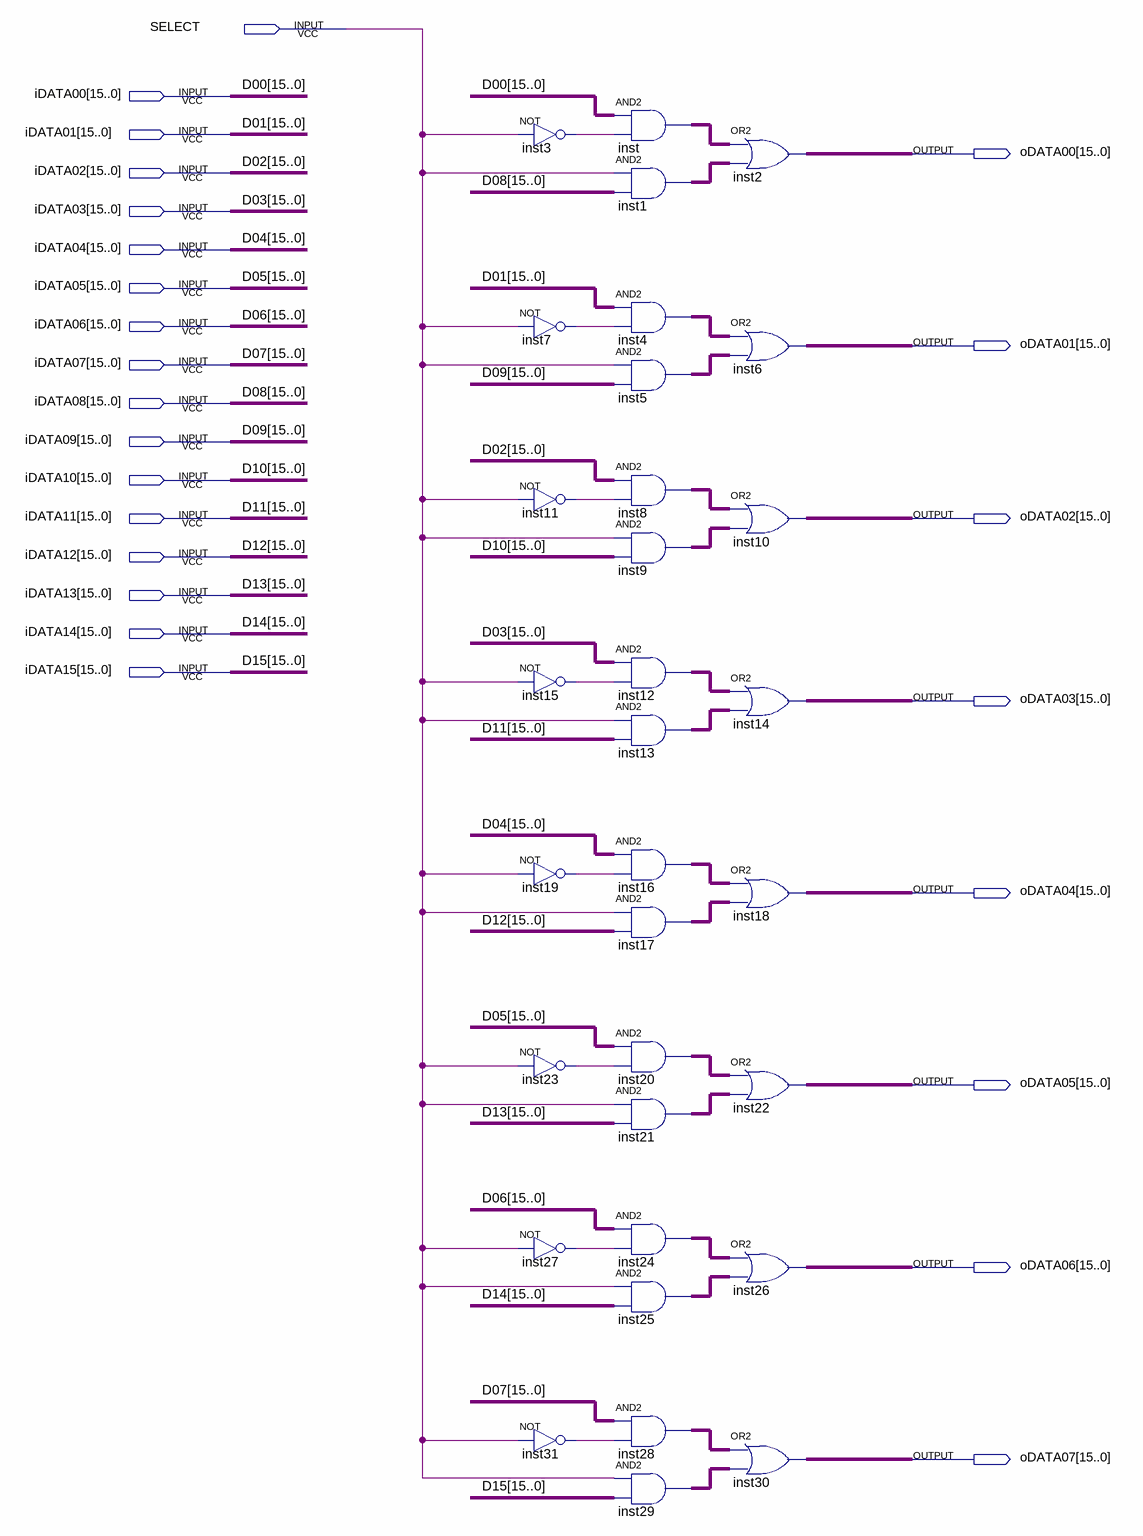
[diagram p0: schematic sheet]
// Quartus schematic disp_selecter.bdf as structural Verilog: 32 symbols, 25 pins
module disp_selecter (
  input  SELECT,
  input  [15:0] iDATA00,
  input  [15:0] iDATA01,
  input  [15:0] iDATA02,
  input  [15:0] iDATA03,
  input  [15:0] iDATA04,
  input  [15:0] iDATA05,
  input  [15:0] iDATA06,
  input  [15:0] iDATA07,
  input  [15:0] iDATA08,
  input  [15:0] iDATA09,
  input  [15:0] iDATA10,
  input  [15:0] iDATA11,
  input  [15:0] iDATA12,
  input  [15:0] iDATA13,
  input  [15:0] iDATA14,
  input  [15:0] iDATA15,
  output [15:0] oDATA00,
  output [15:0] oDATA01,
  output [15:0] oDATA02,
  output [15:0] oDATA03,
  output [15:0] oDATA04,
  output [15:0] oDATA05,
  output [15:0] oDATA06,
  output [15:0] oDATA07
);

  wire inst3_out, inst7_out, inst11_out, inst15_out, inst19_out, inst23_out, inst27_out, inst31_out;
  wire [15:0] inst1_out, inst4_out, inst5_out, inst8_out, inst9_out, inst12_out, inst13_out, inst16_out,
       inst17_out, inst20_out, inst21_out, inst24_out, inst25_out, inst28_out, inst29_out, inst_out;

  not inst3 (inst3_out, SELECT);
  not inst7 (inst7_out, SELECT);
  not inst11 (inst11_out, SELECT);
  not inst15 (inst15_out, SELECT);
  not inst19 (inst19_out, SELECT);
  not inst23 (inst23_out, SELECT);
  not inst27 (inst27_out, SELECT);
  not inst31 (inst31_out, SELECT);
  assign inst_out = iDATA00 & {16{inst3_out}};  // AND2 inst, 16 bits wide
  assign inst1_out = {16{SELECT}} & iDATA08;  // AND2 inst1, 16 bits wide
  assign inst4_out = iDATA01 & {16{inst7_out}};  // AND2 inst4, 16 bits wide
  assign inst5_out = {16{SELECT}} & iDATA09;  // AND2 inst5, 16 bits wide
  assign inst8_out = iDATA02 & {16{inst11_out}};  // AND2 inst8, 16 bits wide
  assign inst9_out = {16{SELECT}} & iDATA10;  // AND2 inst9, 16 bits wide
  assign inst12_out = iDATA03 & {16{inst15_out}};  // AND2 inst12, 16 bits wide
  assign inst13_out = {16{SELECT}} & iDATA11;  // AND2 inst13, 16 bits wide
  assign inst16_out = iDATA04 & {16{inst19_out}};  // AND2 inst16, 16 bits wide
  assign inst17_out = {16{SELECT}} & iDATA12;  // AND2 inst17, 16 bits wide
  assign inst20_out = iDATA05 & {16{inst23_out}};  // AND2 inst20, 16 bits wide
  assign inst21_out = {16{SELECT}} & iDATA13;  // AND2 inst21, 16 bits wide
  assign inst24_out = iDATA06 & {16{inst27_out}};  // AND2 inst24, 16 bits wide
  assign inst25_out = {16{SELECT}} & iDATA14;  // AND2 inst25, 16 bits wide
  assign inst28_out = iDATA07 & {16{inst31_out}};  // AND2 inst28, 16 bits wide
  assign inst29_out = {16{SELECT}} & iDATA15;  // AND2 inst29, 16 bits wide
  assign oDATA00 = inst_out | inst1_out;  // OR2 inst2, 16 bits wide
  assign oDATA01 = inst4_out | inst5_out;  // OR2 inst6, 16 bits wide
  assign oDATA02 = inst8_out | inst9_out;  // OR2 inst10, 16 bits wide
  assign oDATA03 = inst12_out | inst13_out;  // OR2 inst14, 16 bits wide
  assign oDATA04 = inst16_out | inst17_out;  // OR2 inst18, 16 bits wide
  assign oDATA05 = inst20_out | inst21_out;  // OR2 inst22, 16 bits wide
  assign oDATA06 = inst24_out | inst25_out;  // OR2 inst26, 16 bits wide
  assign oDATA07 = inst28_out | inst29_out;  // OR2 inst30, 16 bits wide

  // Other names for the same wires on the sheet: D00[15:0] = iDATA00; D01[15:0] = iDATA01; D02[15:0] = iDATA02;
  //   D03[15:0] = iDATA03; D04[15:0] = iDATA04; D05[15:0] = iDATA05; D06[15:0] = iDATA06; D07[15:0] = iDATA07;
  //   D08[15:0] = iDATA08; D09[15:0] = iDATA09; D10[15:0] = iDATA10; D11[15:0] = iDATA11; D12[15:0] = iDATA12;
  //   D13[15:0] = iDATA13; D14[15:0] = iDATA14; D15[15:0] = iDATA15
endmodule
